# EAGLE design 2009_12_30_sevenSegmentWatch_01_02 (EAGLE 4.16)

## Sheet 1 of 2
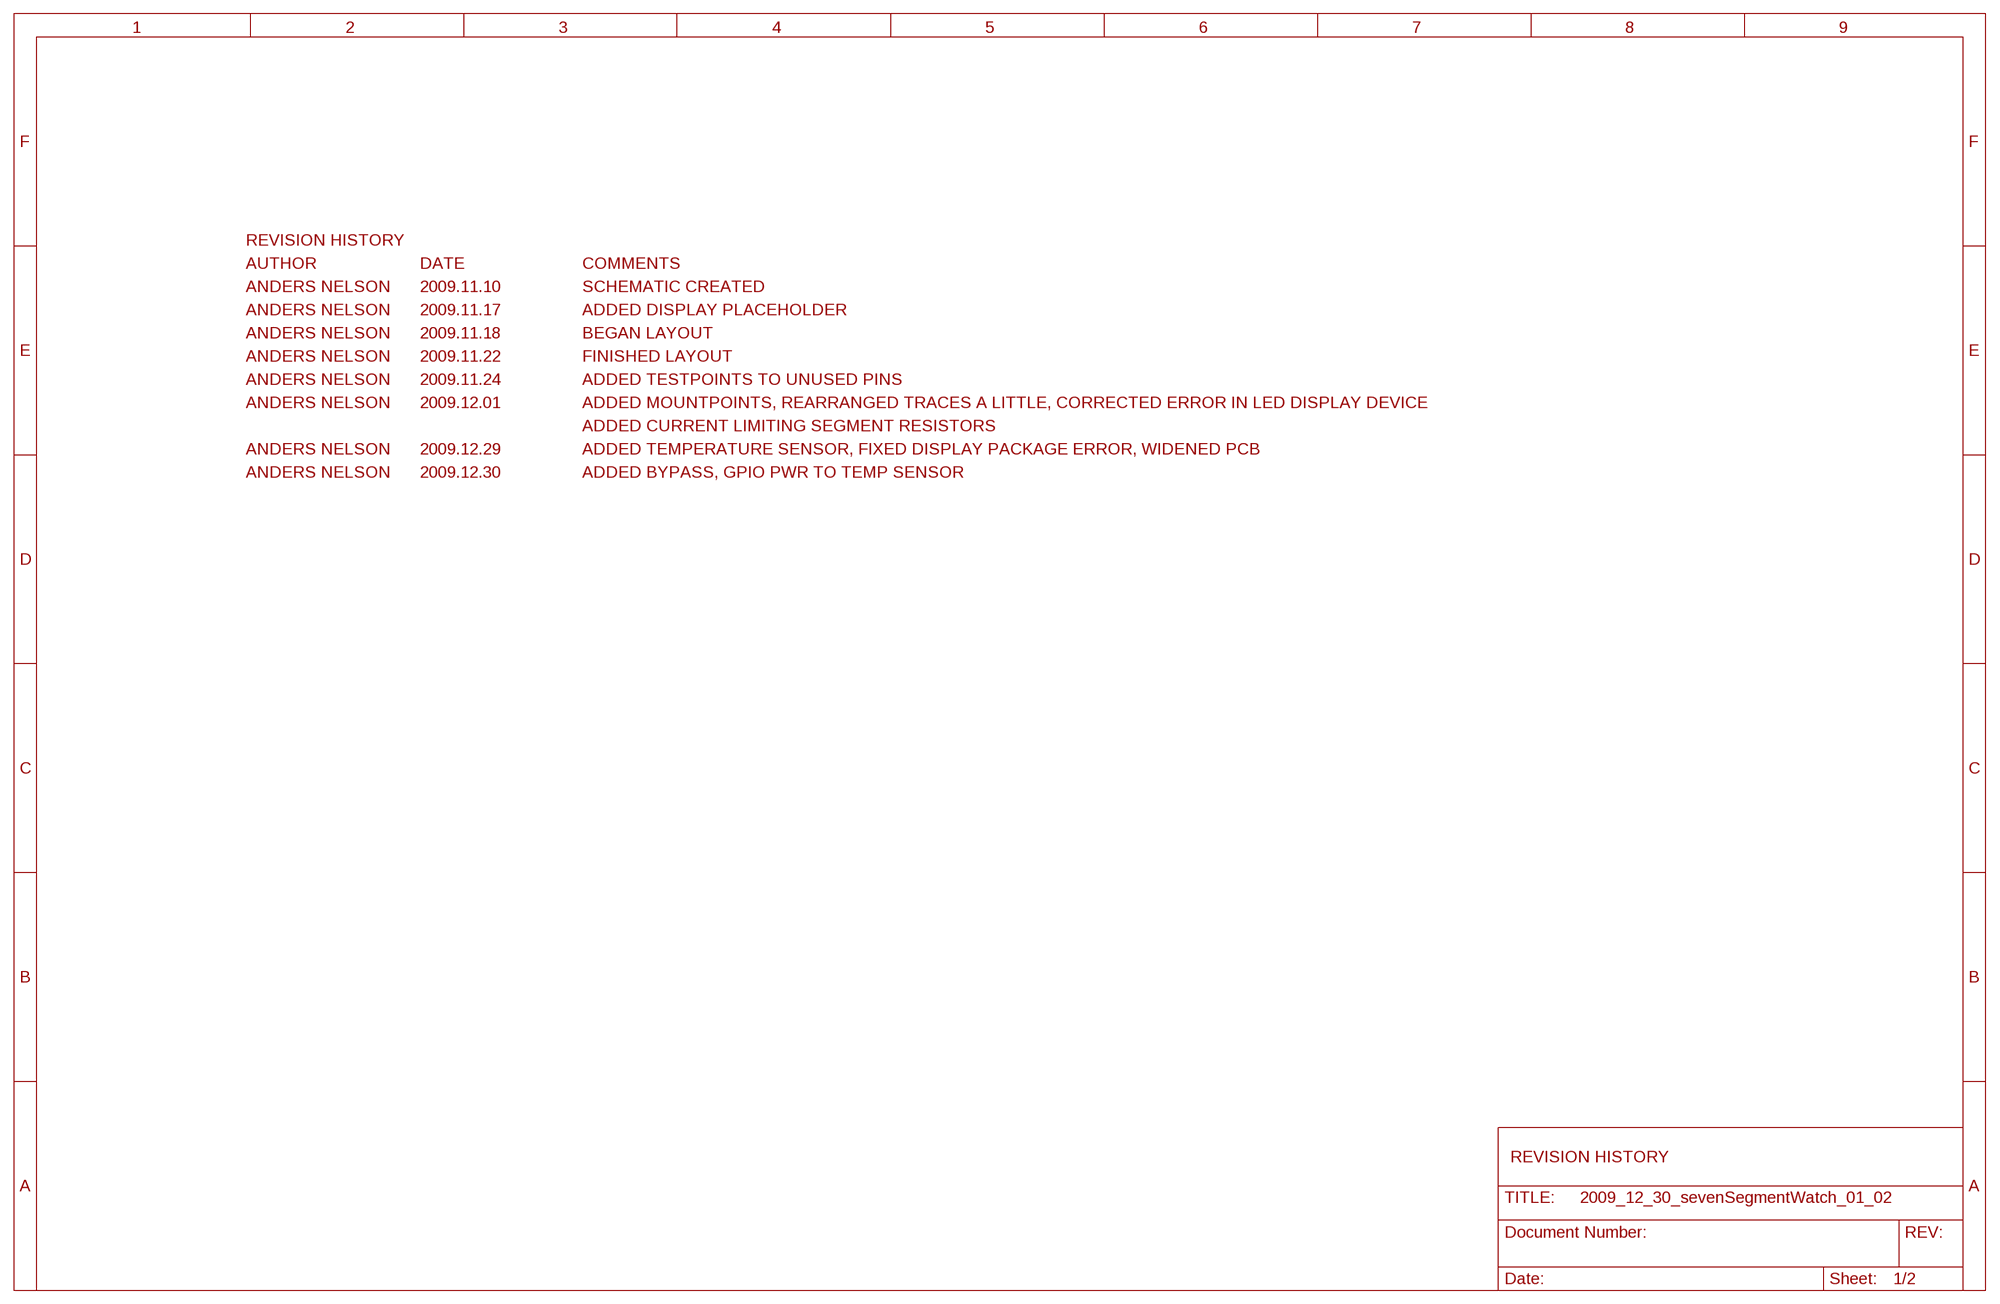
[diagram p0: schematic, sheet 1]

### Notes on the sheet
- REVISION HISTORY
- AUTHOR | DATE | COMMENTS
- ANDERS NELSON | 2009.11.10 | SCHEMATIC CREATED
- ANDERS NELSON | 2009.11.17 | ADDED DISPLAY PLACEHOLDER
- ANDERS NELSON | 2009.11.18 | BEGAN LAYOUT
- ANDERS NELSON | 2009.11.22 | FINISHED LAYOUT
- ANDERS NELSON | 2009.11.24 | ADDED TESTPOINTS TO UNUSED PINS
- ANDERS NELSON | 2009.12.01 | ADDED MOUNTPOINTS, REARRANGED TRACES A LITTLE, CORRECTED ERROR IN LED DISPLAY DEVICE
- ADDED CURRENT LIMITING SEGMENT RESISTORS
- ANDERS NELSON | 2009.12.29 | ADDED TEMPERATURE SENSOR, FIXED DISPLAY PACKAGE ERROR, WIDENED PCB
- ANDERS NELSON | 2009.12.30 | ADDED BYPASS, GPIO PWR TO TEMP SENSOR
- REVISION HISTORY

## Sheet 2 of 2
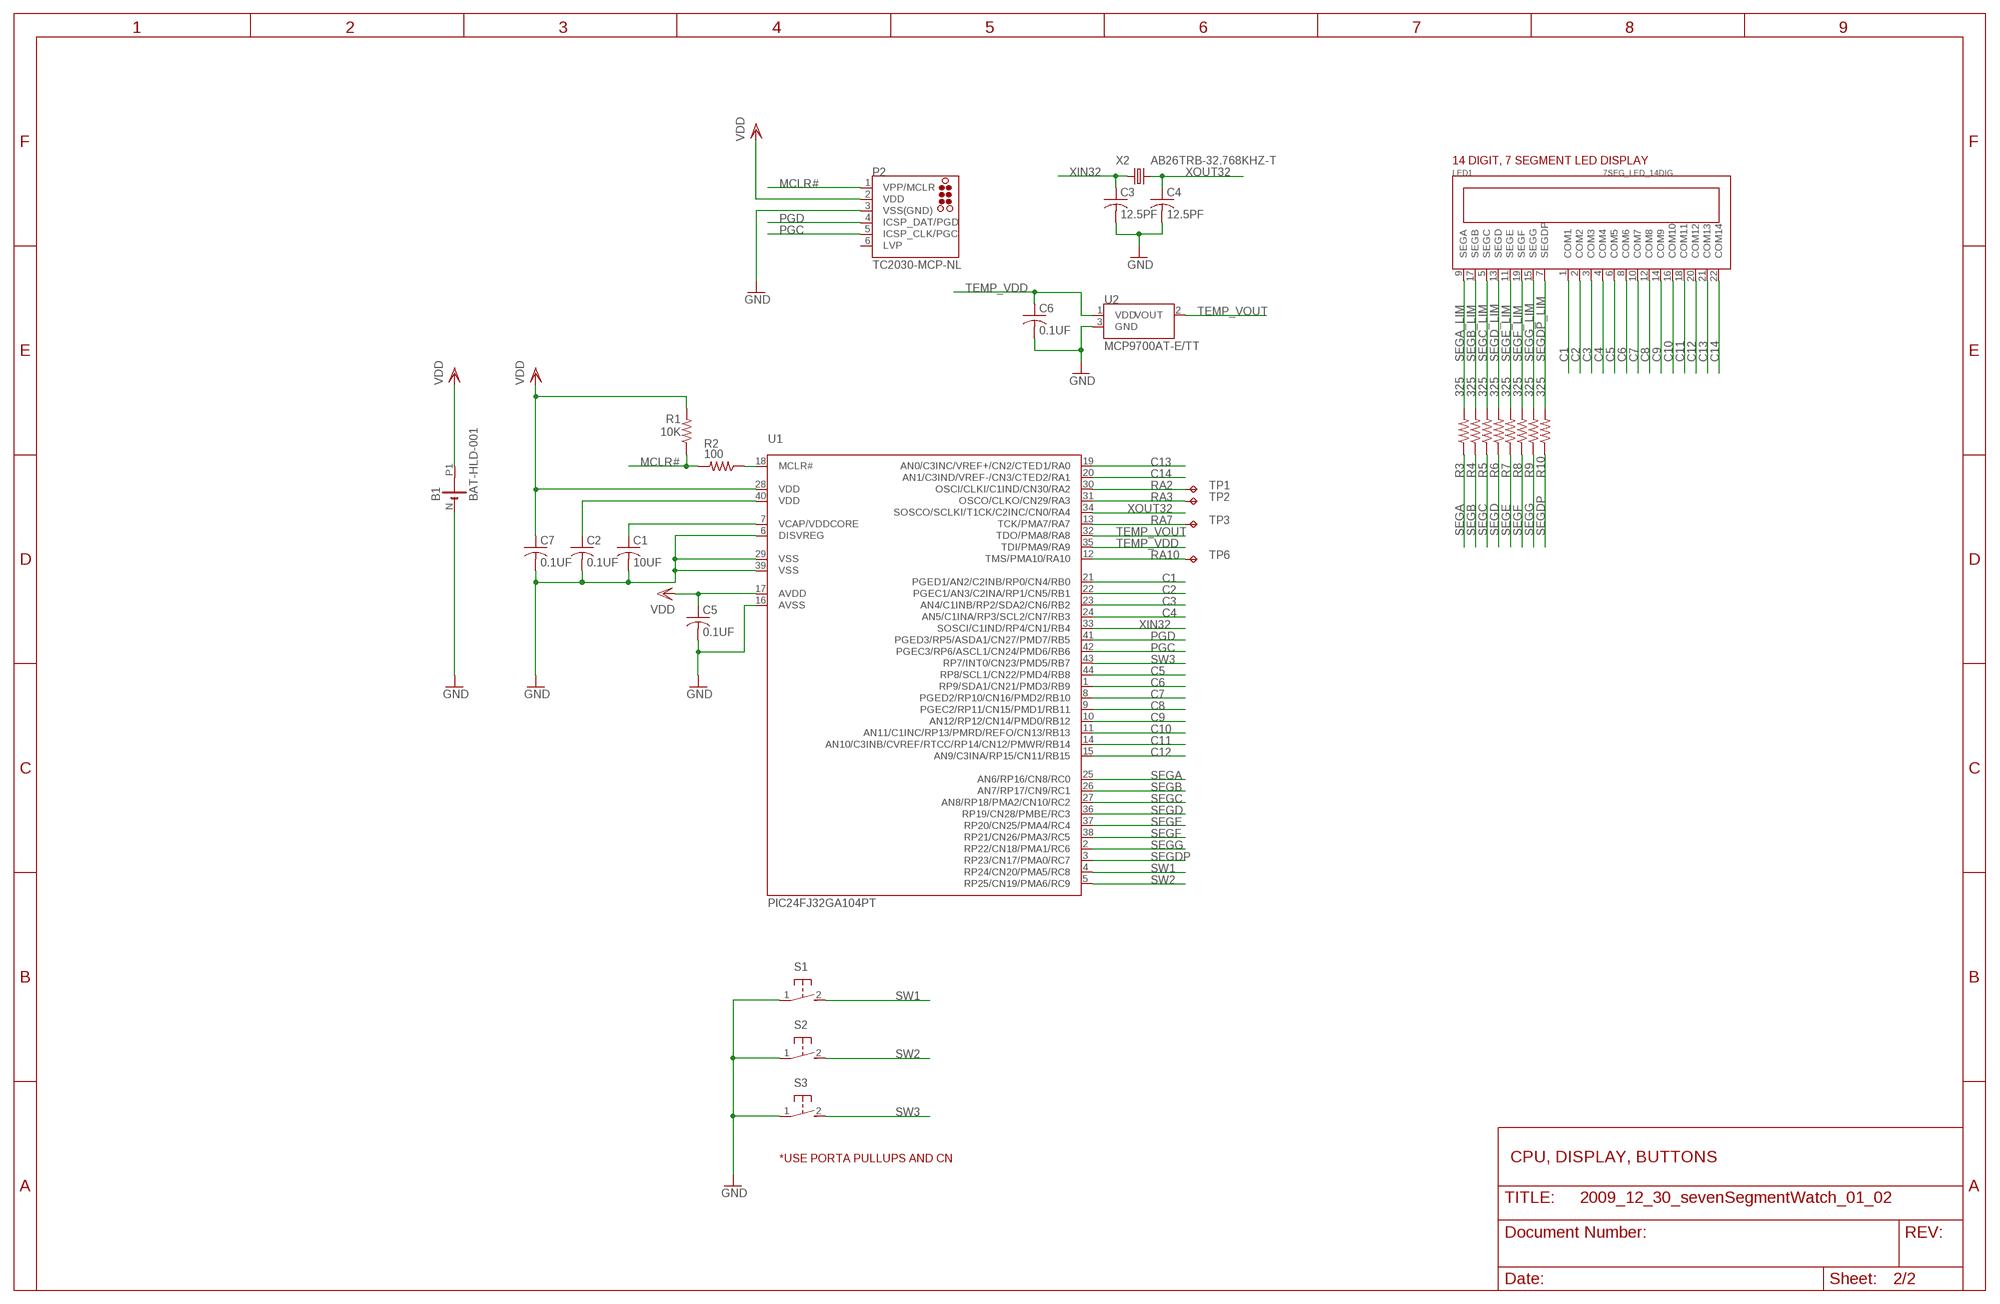
[diagram p1: schematic, sheet 2]

### Parts
B1  BAT-HLD-001  [BAT-HLD-001]
C1  10UF  C-USC0603  [C0603]
C2  0.1UF  C-USC0603  [C0603]
C3  12.5PF  C-USC0603  [C0603]
C4  12.5PF  C-USC0603  [C0603]
C5  0.1UF  C-USC0603  [C0603]
C6  0.1UF  C-USC0603  [C0603]
C7  0.1UF  C-USC0603  [C0603]
LED1  7SEG_LED_14DIG  [7SEG_LED_14DIG]
P2  TC2030-MCP-NL  [TC2030-MCP-NL]
R1  10K  R-US_R0603  [R0603]
R2  100  R-US_R0603  [R0603]
R3  325  R-US_R0402  [R0402]
R4  325  R-US_R0402  [R0402]
R5  325  R-US_R0402  [R0402]
R6  325  R-US_R0402  [R0402]
R7  325  R-US_R0402  [R0402]
R8  325  R-US_R0402  [R0402]
R9  325  R-US_R0402  [R0402]
R10  325  R-US_R0402  [R0402]
S1  31-XX  [B3F-31XX]
S2  31-XX  [B3F-31XX]
S3  31-XX  [B3F-31XX]
TP1  TPB1,27  [B1,27]
TP2  TPB1,27  [B1,27]
TP3  TPB1,27  [B1,27]
TP6  TPB1,27  [B1,27]
U1  PIC24FJ32GA104PT  [TQFP44]
U2  MCP9700AT-E/TT  [SOT23]
X2  AB26TRB-32.768KHZ-T  [CYL_6MM_2MM_SMD]

### Nets
C1: LED1.1(COM1) U1.21(PGED1/AN2/C2INB/RP0/CN4/RB0)
C2: LED1.2(COM2) U1.22(PGEC1/AN3/C2INA/RP1/CN5/RB1)
C3: LED1.3(COM3) U1.23(AN4/C1INB/RP2/SDA2/CN6/RB2)
C4: LED1.4(COM4) U1.24(AN5/C1INA/RP3/SCL2/CN7/RB3)
C5: LED1.6(COM5) U1.44(RP8/SCL1/CN22/PMD4/RB8)
C6: LED1.8(COM6) U1.1(RP9/SDA1/CN21/PMD3/RB9)
C7: LED1.10(COM7) U1.8(PGED2/RP10/CN16/PMD2/RB10)
C8: LED1.12(COM8) U1.9(PGEC2/RP11/CN15/PMD1/RB11)
C9: LED1.14(COM9) U1.10(AN12/RP12/CN14/PMD0/RB12)
C10: LED1.16(COM10) U1.11(AN11/C1INC/RP13/PMRD/REFO/CN13/RB13)
C11: LED1.18(COM11) U1.14(AN10/C3INB/CVREF/RTCC/RP14/CN12/PMWR/RB14)
C12: LED1.20(COM12) U1.15(AN9/C3INA/RP15/CN11/RB15)
C13: LED1.21(COM13) U1.19(AN0/C3INC/VREF+/CN2/CTED1/RA0)
C14: LED1.22(COM14) U1.20(AN1/C3IND/VREF-/CN3/CTED2/RA1)
GND: B1.N(-) C1.2 C2.2 C3.2 C4.2 C5.2 C6.2 C7.2 P2.3(VSS(GND)) S1.1(P) S2.1(P) S3.1(P) U1.6(DISVREG) U1.16(AVSS) U1.29(VSS) U1.39(VSS) U2.3(GND)
MCLR#: P2.1(VPP/MCLR) R1.1 R2.2
N$1: C2.1 U1.40(VDD)
N$2: R2.1 U1.18(MCLR#)
N$7: C1.1 U1.7(VCAP/VDDCORE)
PGC: P2.5(ICSP_CLK/PGC) U1.42(PGEC3/RP6/ASCL1/CN24/PMD6/RB6)
PGD: P2.4(ICSP_DAT/PGD) U1.41(PGED3/RP5/ASDA1/CN27/PMD7/RB5)
RA2: TP1.PP(TP) U1.30(OSCI/CLKI/C1IND/CN30/RA2)
RA3: TP2.PP(TP) U1.31(OSCO/CLKO/CN29/RA3)
RA7: TP3.PP(TP) U1.13(TCK/PMA7/RA7)
RA10: TP6.PP(TP) U1.12(TMS/PMA10/RA10)
SEGA: R3.1 U1.25(AN6/RP16/CN8/RC0)
SEGA_LIM: LED1.9(SEGA) R3.2
SEGB: R4.1 U1.26(AN7/RP17/CN9/RC1)
SEGB_LIM: LED1.17(SEGB) R4.2
SEGC: R5.1 U1.27(AN8/RP18/PMA2/CN10/RC2)
SEGC_LIM: LED1.5(SEGC) R5.2
SEGD: R6.1 U1.36(RP19/CN28/PMBE/RC3)
SEGD_LIM: LED1.13(SEGD) R6.2
SEGDP: R10.1 U1.3(RP23/CN17/PMA0/RC7)
SEGDP_LIM: LED1.7(SEGDP) R10.2
SEGE: R7.1 U1.37(RP20/CN25/PMA4/RC4)
SEGE_LIM: LED1.11(SEGE) R7.2
SEGF: R8.1 U1.38(RP21/CN26/PMA3/RC5)
SEGF_LIM: LED1.19(SEGF) R8.2
SEGG: R9.1 U1.2(RP22/CN18/PMA1/RC6)
SEGG_LIM: LED1.15(SEGG) R9.2
SW1: S1.2(S) U1.4(RP24/CN20/PMA5/RC8)
SW2: S2.2(S) U1.5(RP25/CN19/PMA6/RC9)
SW3: S3.2(S) U1.43(RP7/INT0/CN23/PMD5/RB7)
TEMP_VDD: C6.1 U1.35(TDI/PMA9/RA9) U2.1(VDD)
TEMP_VOUT: U1.32(TDO/PMA8/RA8) U2.2(VOUT)
VDD: B1.P1(+) C5.1 C7.1 P2.2(VDD) R1.2 U1.17(AVDD) U1.28(VDD)
XIN32: C3.1 U1.33(SOSCI/C1IND/RP4/CN1/RB4) X2.3
XOUT32: C4.1 U1.34(SOSCO/SCLKI/T1CK/C2INC/CN0/RA4) X2.2
Unconnected: B1.P2(+) P2.6(LVP)

### Notes on the sheet
- 14 DIGIT, 7 SEGMENT LED DISPLAY
- *USE PORTA PULLUPS AND CN | CPU, DISPLAY, BUTTONS

## Library data of the parts
B1 = sevenSegmentWatch:BAT-HLD-001
C1-C7 = rcl:C-US: CAPACITOR, American symbol
LED1 = sevenSegmentWatch:7SEG_LED_14DIG
P2 = raveGearControl:TC2030: TAG-CONNECT ISP Connector Manufacturer: Tag-Connect <www.tag-connect.com> Cable for easy In-Circuit PCB Programming. Designed for Microchip ICD2, suitable for many others. Two variants - one "with legs" (for hads-free fit on PCB) and another "without legs" for quick programming. PAD Description 1 MCLR/Vpp 2 Vdd 3 GND 4 PGD (ISPDAT) 5 PGC (ISPCLK) 6 nc (used for LVP) ©2009 ROFA.cz
R1-R10 = rcl:R-US_: RESISTOR, American symbol
S1-S3 = switch-omron:31-XX: OMRON SWITCH
TP1-TP3 TP6 = testpad:TP
U1 = sevenSegmentWatch:PIC24FJ*
U2 = sevenSegmentWatch:MCP97*
X2 = raveGearControl2:AB26TRB-32.768KHZ-T

## Board
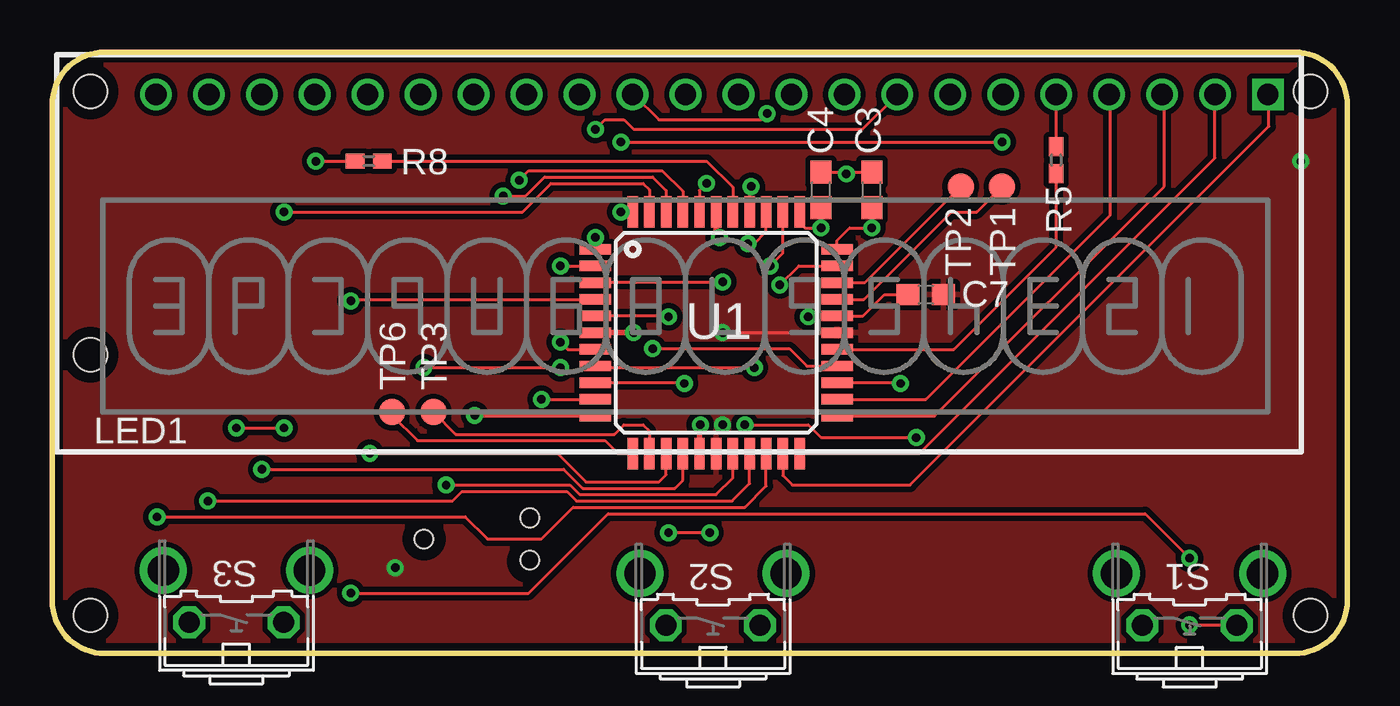
[diagram p2: board, top side]
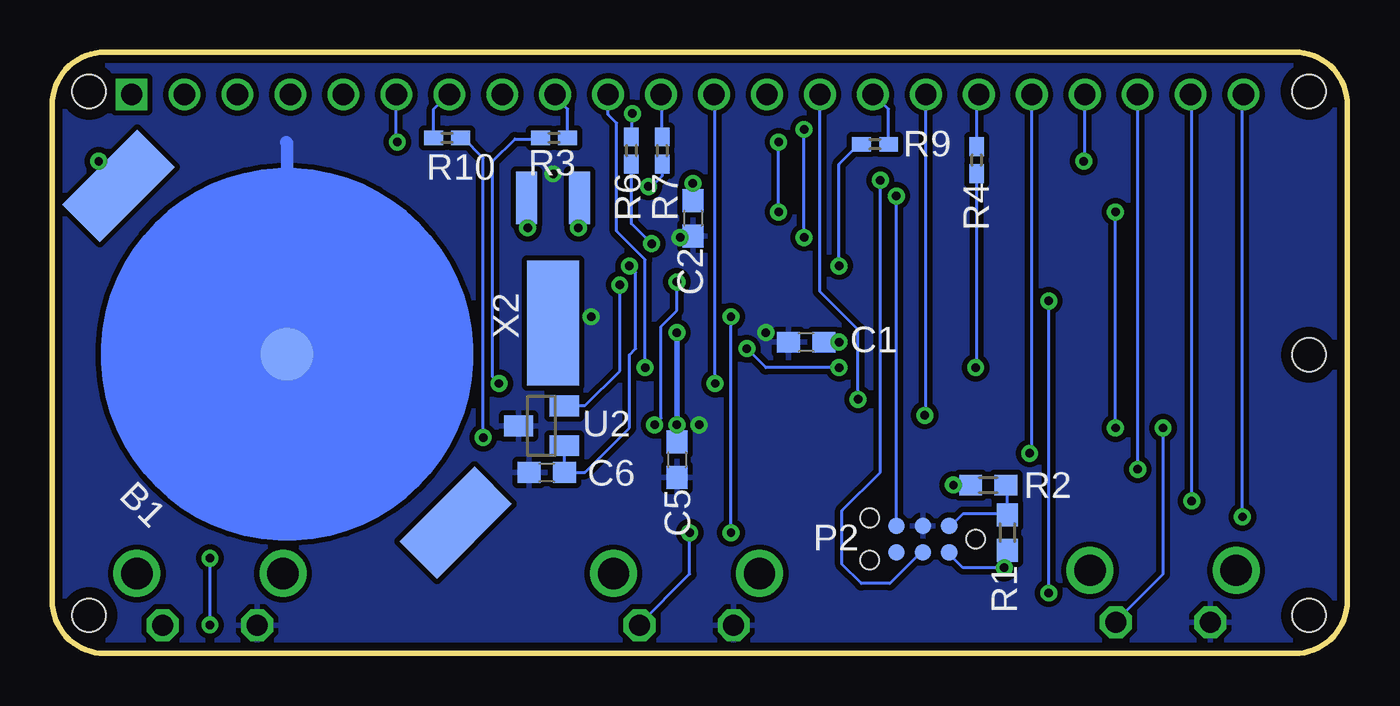
[diagram p3: board, bottom side, seen from below]

Size 62.13 x 28.85 mm. Coordinates in mm from the lower left corner, seen from the top.
Outline: 59.59,0 arc90 62.13,2.54 62.13,26.31 arc90 59.59,28.85 2.54,28.85 arc90 0,26.31 0,2.54 arc90 2.54,0 59.59,0
Copper layers (1*16): Top 0.0356mm / dielectric 0.2007mm / Bottom 0.0356mm
Design rules "PCBExpress_E2": minimum track width 6mil, minimum drill 16mil, track to track 6mil, track to pad 6mil, pad to pad 6mil, via to via 6mil, smd to smd 0mil, copper to edge 15mil, drill to drill 8mil, minimum pad ring 10mil, minimum via ring 8mil, stop-mask expansion 4mil, vias tented up to drill 16mil, thermal gap 10mil
Holes 1.6 mm at 1.83,1.83 60.35,1.83 60.35,26.97 1.83,26.97 1.83,14.33
tRestrict: area 22.1,5.8 to 23.6,7.3; area 22.1,3.6 to 23.6,5.2; area 17.1,4.7 to 18.6,6.3; area 0.8,0.8 to 2.9,2.9; area 59.3,0.8 to 61.4,2.9; area 59.3,25.9 to 61.4,28; area 0.8,25.9 to 2.9,28.1; area 0.8,13.2 to 2.9,15.4
bRestrict: area 22.1,5.8 to 23.6,7.3; area 22.1,3.6 to 23.6,5.2; area 17.1,4.7 to 18.6,6.2; area 0.7,25.9 to 2.9,28.1; area 59.2,25.9 to 61.5,28.1; area 59.3,0.7 to 61.4,2.9; area 0.8,0.8 to 2.9,2.9; area 0.8,13.2 to 2.9,15.4

### Footprints (pad centres in the part's own frame; a part is rotated, then mirrored left to right if it is on the bottom)
BAT-HLD-001 = smd 2.54 x 2.54: N 0,0 | smd 2.54 x 5.08: P1 -11.43,0; P2 11.43,0
C0603 = smd 1.1 x 1: 1 -0.85,0; 2 0.85,0
7SEG_LED_14DIG = drill 1.016 square: 1 -26.67,-7.62 | drill 1.016 round: 2 -24.13,-7.62; 3 -21.59,-7.62; 4 -19.05,-7.62; 5 -16.51,-7.62; 6 -13.97,-7.62; 7 -11.43,-7.62; 8 -8.89,-7.62; 9 -6.35,-7.62; 10 -3.81,-7.62; 11 -1.27,-7.62; 12 1.27,-7.62; 13 3.81,-7.62; 14 6.35,-7.62; 15 8.89,-7.62; 16 11.43,-7.62; 17 13.97,-7.62; 18 16.51,-7.62; 19 19.05,-7.62; 20 21.59,-7.62; 21 24.13,-7.62; 22 26.67,-7.62
TC2030-MCP-NL = smd 0.787 x 0.787: 1 1.27,-0.635; 2 1.27,0.635; 3 2.54,-0.635; 4 2.54,0.635; 5 3.81,-0.635; 6 3.81,0.635 | hole 0.889: 0,0; 5.08,-1.016; 5.08,1.016
R0603 = smd 1.1 x 1: 1 -0.85,0; 2 0.85,0
R0402 = smd 0.9 x 0.7: 1 -0.65,0; 2 0.65,0
B3F-31XX = drill 1.016 octagon: 1 -2.261,-1.245; 2 2.261,-1.245 | drill 1.499 pad 2.159 round: 3 -3.505,1.245; 4 3.505,1.245
B1,27 = smd 1.27 x 1.27: PP 0,0
TQFP44 = smd 1.5 x 0.5: 1 -5.8,4; 2 -5.8,3.2; 3 -5.8,2.4; 4 -5.8,1.6; 5 -5.8,0.8; 6 -5.8,0; 7 -5.8,-0.8; 8 -5.8,-1.6; 9 -5.8,-2.4; 10 -5.8,-3.2; 11 -5.8,-4; 23 5.8,-4; 24 5.8,-3.2; 25 5.8,-2.4; 26 5.8,-1.6; 27 5.8,-0.8; 28 5.8,0; 29 5.8,0.8; 30 5.8,1.6; 31 5.8,2.4; 32 5.8,3.2; 33 5.8,4 | smd 0.5 x 1.5: 12 -4,-5.8; 13 -3.2,-5.8; 14 -2.4,-5.8; 15 -1.6,-5.8; 16 -0.8,-5.8; 17 0,-5.8; 18 0.8,-5.8; 19 1.6,-5.8; 20 2.4,-5.8; 21 3.2,-5.8; 22 4,-5.8; 34 4,5.8; 35 3.2,5.8; 36 2.4,5.8; 37 1.6,5.8; 38 0.8,5.8; 39 0,5.8; 40 -0.8,5.8; 41 -1.6,5.8; 42 -2.4,5.8; 43 -3.2,5.8; 44 -4,5.8
SOT23 = smd 1 x 1.4: 1 -0.95,-1.1; 2 0.95,-1.1; 3 0,1.1
CYL_6MM_2MM_SMD = smd 6 x 2.5: 1 -2.125,0 | smd 2.5 x 1: 2 3.875,-1.27; 3 3.875,1.27

### Placement (x,y rotation side)
B1  50.86,14.35 315 bottom
C1  25.96,14.94 180 bottom
C2  31.39,20.88 270 bottom
C3  39.32,22.25 90 top
C4  36.88,22.25 90 top
C5  32.16,9.3 270 bottom
C6  38.4,8.69 180 bottom
C7  41.91,17.22 180 top
LED1  31.65,19.2 180 top
P2  17.83,5.49 180 bottom
R1  16.31,5.79 270 bottom
R2  17.22,8.08 0 bottom
R3  38.05,24.74 0 bottom
R4  17.78,23.67 90 bottom
R5  48.16,23.67 90 top
R6  34.34,24.13 90 bottom
R7  32.87,24.13 90 bottom
R8  15.19,23.62 180 top
R9  22.66,24.43 0 bottom
R10  43.18,24.74 180 bottom
S1  54.56,2.59 0 top
S2  31.7,2.59 0 top
S3  8.84,2.74 0 top
TP1  45.57,22.4 0 top
TP2  43.59,22.4 0 top
TP3  18.29,11.58 0 top
TP6  16.31,11.58 0 top
U1  31.85,15.39 0 top
U2  38.66,10.92 90 bottom
X2  38.1,17.98 90 bottom

### Tracks (layer width: path | path; a pad name or v marks a point on that pad's centre or on a via)
C1
  Top 0.152: U1.21 35.05,8.54 35.51,8.08 41.15,8.08 58.37,25.3 58.37,26.82 LED1.1
C2
  Top 0.152: U1.22 41.6,9.59 55.78,23.77 LED1.2
C3
  Top 0.152: U1.23 42.33,11.39 53.34,22.4 53.34,26.67 53.19,26.82 LED1.3
C4
  Top 0.152: U1.24 41.91,12.19 50.75,21.03 50.75,26.82 LED1.4
C5  (via drill 0.41)
  Top 0.152: U1.44 27.29,21.19 v27.28,21.18 | v27.28,24.54 v45.57,24.54
  Bottom 0.152: LED1.6 45.62,24.43 v45.57,24.54 | v27.28,21.18 v27.28,24.54
C6  (via drill 0.41)
  Top 0.152: v26.06,25.15 26.52,25.6 27.43,25.6 27.89,25.15 38.86,25.15 LED1.8 | U1.1 v26.05,19.96 v26.06,19.96
  Bottom 0.152: v26.06,19.96 v26.06,25.15
C7  (via drill 0.41)
  Top 0.152: U1.8 26.05,13.86 26.06,13.87 26.21,13.72 v33.68,13.72
  Bottom 0.152: LED1.10 35.46,25.86 35.05,25.45 35.05,20.27 33.68,18.9 v33.68,13.72
C8  (via drill 0.41)
  Top 0.152: U1.9 30.29,12.99 v30.33,12.95
  Bottom 0.152: LED1.12 30.33,26.82 v30.33,12.95
C9  (via drill 0.41)
  Top 0.152: U1.10 v23.47,12.19
  Bottom 0.152: LED1.14 25.3,17.37 23.47,15.54 v23.47,12.19
C10  (via drill 0.41)
  Top 0.152: v20.27,11.43 20.12,11.43 20.15,11.39 U1.11
  Bottom 0.152: LED1.16 20.22,11.48 v20.27,11.43
C11  (via drill 0.41)
  Top 0.152: U1.14 29.45,8.57 29.11,8.23 25.6,8.23 24.23,9.6 v15.24,9.6
  Bottom 0.152: LED1.18 15.14,9.65 v15.24,9.6
C12  (via drill 0.41)
  Top 0.152: U1.15 30.25,8.31 29.87,7.92 25.45,7.92 24.54,8.84 v10.06,8.84
  Bottom 0.152: v10.06,8.84 LED1.20
C13  (via drill 0.41)
  Top 0.152: U1.19 33.45,8.15 32.61,7.32 25.15,7.32 24.69,7.77 19.66,7.77 19.2,7.32 v7.47,7.32
  Bottom 0.152: LED1.21 7.52,26.87 7.47,26.82 v7.47,7.32
C14  (via drill 0.41)
  Top 0.152: U1.20 34.25,8.04 33.22,7.01 24.99,7.01 23.47,5.49 20.88,5.49 19.81,6.55 v5.03,6.55
  Bottom 0.152: LED1.22 4.98,26.87 5.03,26.82 v5.03,6.55
GND  (via drill 0.41)
  Top 0.152: C4.2 38.01,23.1 v38.1,23.01 38.19,23.1 C3.2 | U1.29 38.9,16.19 39.93,17.22 C7.2
  Top 0.254: U1.6 v27.89,15.39 | U1.29 36.31,16.19 v36.27,16.15 | U1.39 31.85,20.12 v32,19.96 | U1.16 31.05,10.94 v31.09,10.97
  Bottom 0.61: B1.N 50.86,24.49 50.9,24.54
  pour Bottom (isolate 0.254): 0,28.85 62.13,28.85 62.13,0 0,0
MCLR#
  Bottom 0.152: R2.2 16.31,8.08 16.31,6.71 | P2.1 19.02,6.12 18.44,6.71 16.31,6.71 | R1.1 16.31,6.71
N$1  (via drill 0.41)
  Top 0.152: U1.40 31.05,22.21 v31.39,22.55
  Bottom 0.152: C2.1 v31.39,22.55
N$2  (via drill 0.41)
  Top 0.152: U1.18 32.65,8.42 31.85,7.62 25.3,7.62 24.84,8.08 v18.9,8.08
  Bottom 0.152: R2.1 v18.9,8.08
N$7  (via drill 0.41)
  Top 0.152: U1.7 24.73,14.59 v24.38,14.94
  Bottom 0.152: C1.1 v24.38,14.94
PGC  (via drill 0.41)
  Top 0.152: U1.42 29.45,22.21 28.8,22.86 23.62,22.86 22.71,21.95 v21.64,21.95
  Bottom 0.152: 21.64,6.1 P2.5 v21.64,21.95
PGD  (via drill 0.41)
  Top 0.152: U1.41 30.25,22.17 29.26,23.16 22.86,23.16 v22.4,22.71
  Bottom 0.152: P2.4 20.45,4.85 21.95,3.35 23.32,3.35 24.23,4.27 24.23,6.86 22.4,8.69 v22.4,22.71
RA2
  Top 0.152: U1.30 38.94,16.99 43.13,21.18 44.35,21.18 TP1.PP
RA3
  Top 0.152: U1.31 38.98,17.79 TP2.PP
RA7
  Top 0.152: U1.13 28.65,10.67 28.35,10.97 27.43,10.97 26.98,10.52 19.36,10.52 TP3.PP
RA10
  Top 0.152: U1.12 27.14,9.59 26.52,10.21 17.53,10.21 16.31,11.43 TP6.PP
SEGA  (via drill 0.41)
  Top 0.152: U1.25 40.73,12.99 v40.69,12.95
  Bottom 0.152: v40.69,12.95 41,13.26 41,23.62 39.93,24.69 38.71,24.69 38.7,24.7 R3.1
SEGA_LIM
  Bottom 0.152: LED1.9 38.1,26.82 37.4,26.12 R3.2
SEGB  (via drill 0.41)
  Top 0.152: U1.26 36.2,13.79 35.36,14.63 v28.8,14.63 | v17.83,13.72 v24.38,13.72
  Bottom 0.152: v28.8,14.63 27.89,13.72 v24.38,13.72 | R4.1 17.78,13.82 v17.83,13.72
SEGB_LIM
  Bottom 0.152: LED1.17 17.68,26.67 17.78,26.57 R4.2
SEGC
  Top 0.152: U1.27 43.24,14.59 48.16,19.51 R5.1
SEGC_LIM
  Top 0.152: R5.2 LED1.5
SEGD  (via drill 0.41)
  Top 0.152: v33.38,19.66 33.68,19.66 34.25,20.23 U1.36
  Bottom 0.152: R6.1 34.34,20.62 v33.38,19.66
SEGD_LIM  (via drill 0.41)
  Top 0.152: v34.29,25.91 33.98,25.6 29.11,25.6 27.89,26.82 LED1.13
  Bottom 0.152: R6.2 34.34,25.86 v34.29,25.91
SEGDP  (via drill 0.41)
  Top 0.152: U1.3 32.12,17.79 v32.16,17.83 | v33.22,10.97 36.27,10.97 36.88,10.36 v41.45,10.36
  Bottom 0.152: v32.16,17.83 32.16,16.46 32.92,15.7 32.92,11.28 v33.22,10.97 | R10.1 42.42,24.74 41.45,23.77 v41.45,10.36
SEGDP_LIM
  Bottom 0.152: LED1.7 43.13,26.82 43.83,26.12 R10.2
SEGE  (via drill 0.41)
  Top 0.152: U1.37 33.45,22.33 v33.53,22.4
  Bottom 0.152: v33.53,22.4 33.38,22.4 32.87,22.91 R7.1
SEGE_LIM
  Bottom 0.152: R7.2 32.87,26.77 LED1.11
SEGF
  Top 0.152: U1.38 32.65,22.36 31.39,23.62 R8.1
SEGF_LIM  (via drill 0.41)
  Top 0.152: v12.65,23.62 R8.2
  Bottom 0.152: LED1.19 12.6,23.67 v12.65,23.62
SEGG  (via drill 0.41)
  Top 0.152: U1.2 v24.38,18.59
  Bottom 0.152: v24.38,18.59 24.38,23.47 23.42,24.43 R9.1
SEGG_LIM
  Bottom 0.152: LED1.15 22.71,26.82 22.01,26.12 R9.2
SW1  (via drill 0.41)
  Top 0.152: U1.4 14.4,16.99 v14.33,16.92 | v14.33,2.9 22.86,2.9 26.67,6.71 52.43,6.71 v54.56,4.57 | S1.2 56.84,1.37 v54.56,1.37
  Bottom 0.152: v14.33,2.9 v14.33,16.92 | v54.56,4.57 v54.56,1.37
SW2  (via drill 0.41)
  Top 0.152: U1.5 29.53,16.19 v29.57,16.15 | v31.55,5.79 v29.57,5.79
  Bottom 0.152: v29.57,5.79 v29.57,16.15 | S2.2 33.98,1.37 31.55,3.81 v31.55,5.79
SW3  (via drill 0.41)
  Top 0.152: U1.43 28.65,22.25 28.35,22.55 23.93,22.55 22.55,21.18 v11.12,21.18 | v8.84,10.82 v11.12,10.82
  Bottom 0.152: v11.12,10.82 v11.12,21.18 | S3.2 11.1,1.55 8.84,3.81 v8.84,10.82
TEMP_VDD  (via drill 0.41)
  Top 0.152: U1.35 35.05,19.2 v34.44,18.59
  Bottom 0.152: v34.44,18.59 34.14,18.29 34.14,14.63 34.44,14.33 34.44,10.82 36.58,8.69 C6.1 37.55,9.84 37.49,9.91 U2.1
TEMP_VOUT  (via drill 0.41)
  Top 0.152: U1.32 35.81,18.59 v34.9,17.68
  Bottom 0.152: v34.9,17.68 34.9,13.56 36.58,11.89 37.49,11.89 37.51,11.87 U2.2
VDD  (via drill 0.41)
  Top 0.152: v32.16,15.39 U1.28
  Bottom 0.152: v16.46,4.12 18.44,4.12 19.18,4.85 | v16.46,4.12 16.39,4.2 | 19.18,4.85 19.2,4.88 | 19.18,4.85 P2.2 | v16.46,4.12 16.31,4.27 R1.2
  Bottom 0.254: C5.1 v32.16,10.97 v32.16,15.39
  Bottom 0.61: B1.P1 58.94,22.67 v59.89,23.62
  pour Top (isolate 0.254): 0,28.85 62.13,28.85 62.13,0 0,0
XIN32  (via drill 0.41)
  Top 0.152: U1.33 37.65,19.82 38.25,20.42 v39.32,20.42 C3.1
  Bottom 0.152: X2.3 39.37,20.47 v39.32,20.42
XOUT32  (via drill 0.41)
  Top 0.152: U1.34 35.85,20.69 36.12,20.42 v36.88,20.42 C4.1
  Bottom 0.152: X2.2 36.83,20.47 v36.88,20.42

### Text on the board
Document: (C) 2009 AKN | DISPLAY | ADJUST